# EAGLE schematic sha2017_rev1_0_0 (EAGLE 6.6.0)
Assembly variants: PRODUCTION

## Sheet 1 of 3
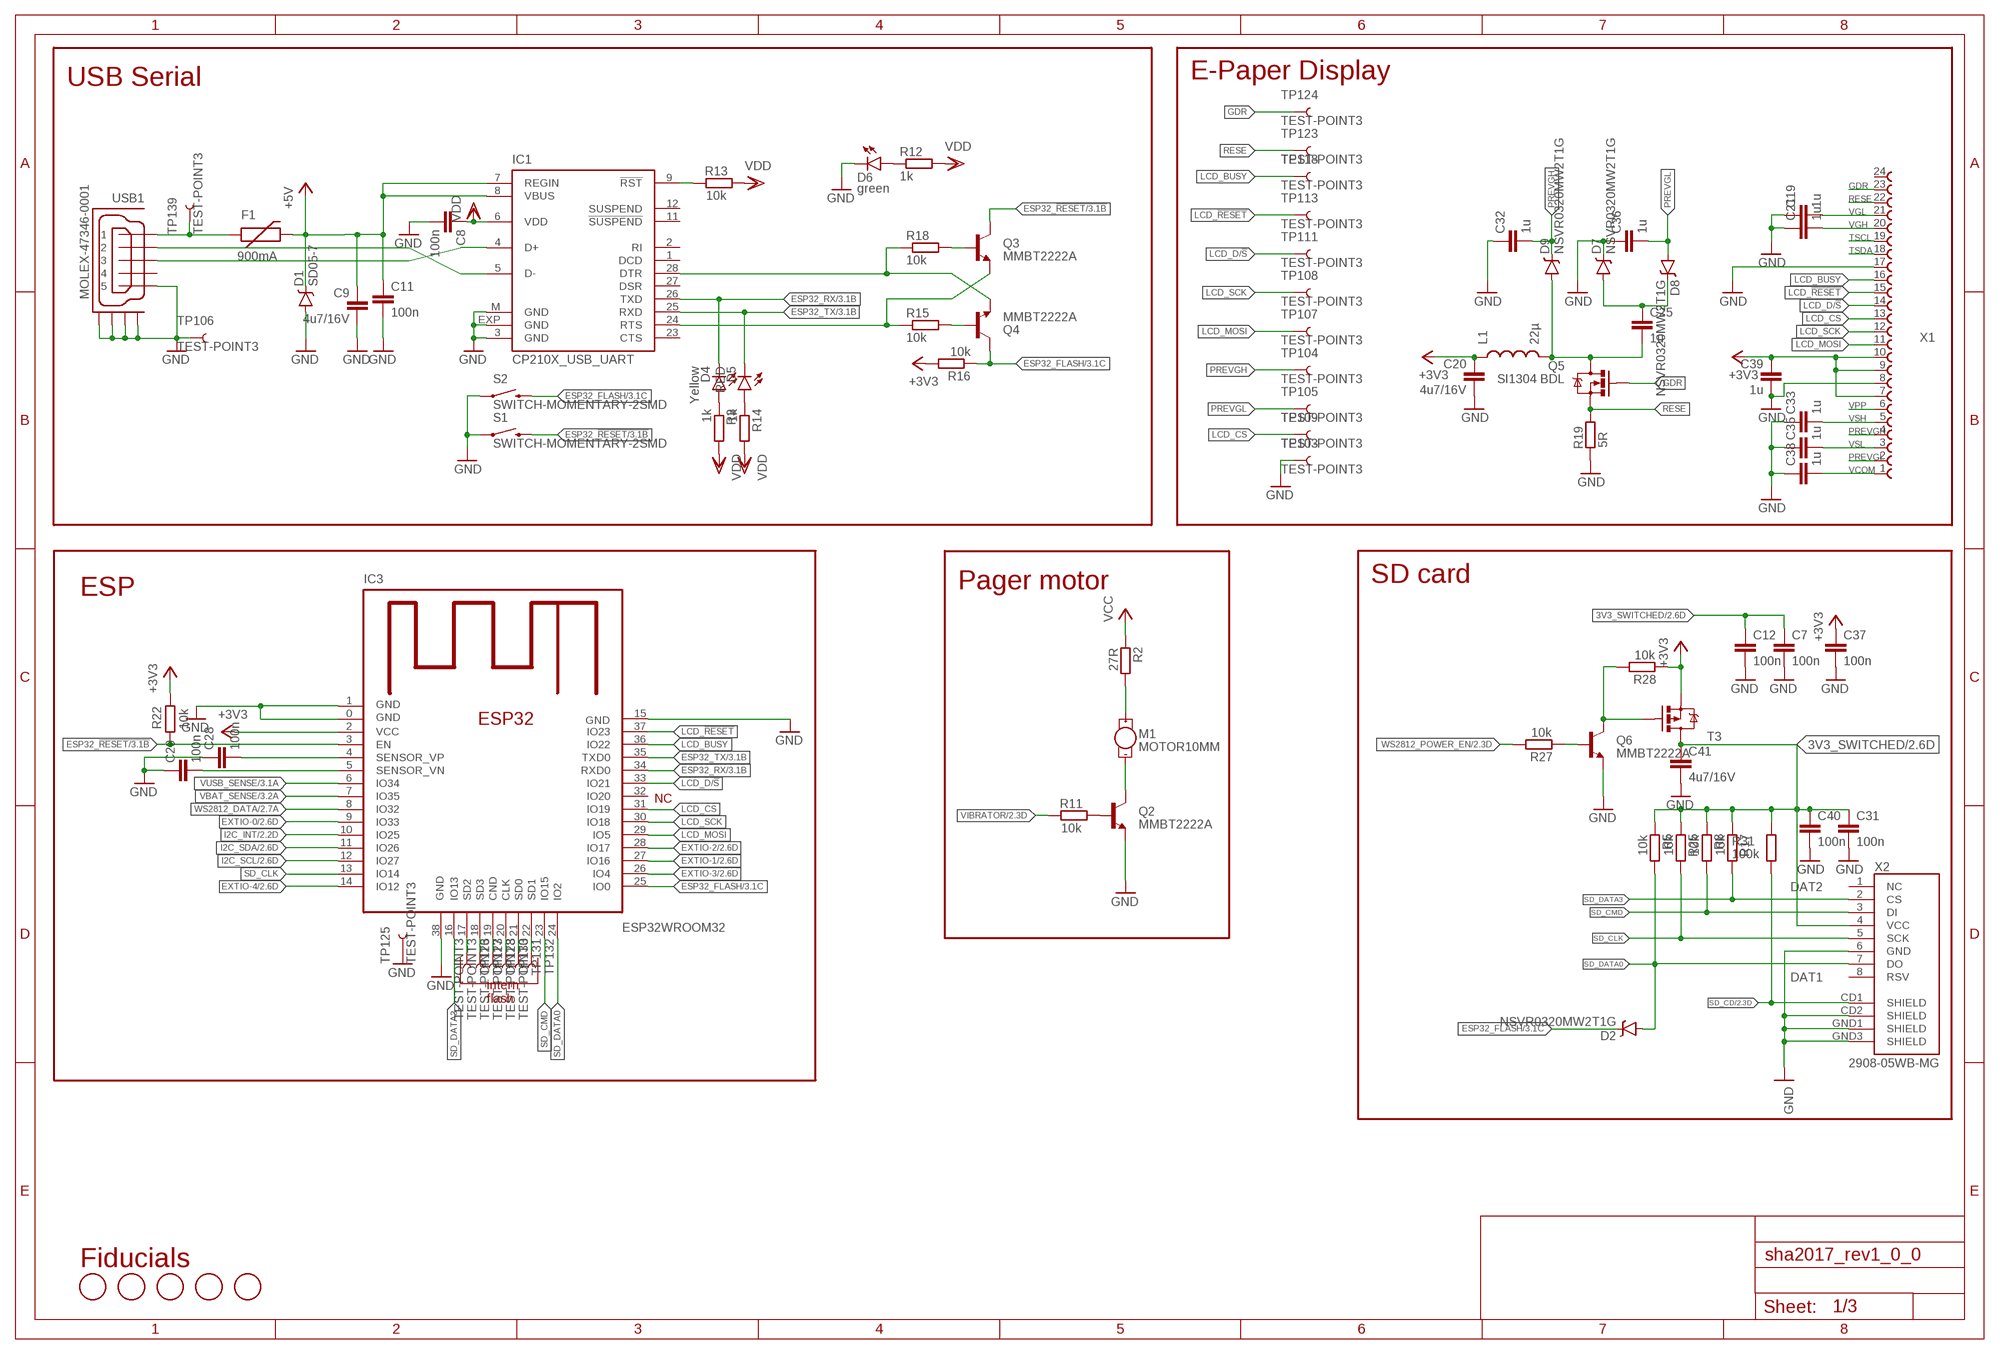
[diagram p0: schematic, sheet 1]

### Parts
C7  100n  C0603-DASHES  [C0603-DASHES]
C8  100n  C0603-DASHES  [C0603-DASHES]
C9  4u7/16V  C-EUC0805  [C0805]
C11  100n  C0603-DASHES  [C0603-DASHES]
C12  100n  C0603-DASHES  [C0603-DASHES]
C19  1u  C0603-DASHES  [C0603-DASHES]
C20  4u7/16V  C-EUC0805  [C0805]
C21  1u  C0603-DASHES  [C0603-DASHES]
C25  1u  C0603-DASHES  [C0603-DASHES]
C28  100n  C0603-DASHES  [C0603-DASHES]
C29  100n  C0603-DASHES  [C0603-DASHES]
C31  100n  C0603-DASHES  [C0603-DASHES]
C32  1u  C0603-DASHES  [C0603-DASHES]
C33  1u  C0603-DASHES  [C0603-DASHES]
C35  1u  C0603-DASHES  [C0603-DASHES]
C36  1u  C0603-DASHES  [C0603-DASHES]
C37  100n  C0603-DASHES  [C0603-DASHES]
C38  1u  C0603-DASHES  [C0603-DASHES]
C39  1u  C0603-DASHES  [C0603-DASHES]
C40  100n  C0603-DASHES  [C0603-DASHES]
C41  4u7/16V  C-EUC0805  [C0805]
D1  SD05-7  DIODE-SCHOTTKY-PMEG4005EJ  [SOD-323]
D2  NSVR0320MW2T1G  BAT20JFILM  [SOD-323]
D4  Yellow  LED0603  [LED-0603]
D5  RED  LED0603  [LED-0603]
D6  green  LED0603  [LED-0603]
D7  NSVR0320MW2T1G  BAT20JFILM  [SOD-323]
D8  NSVR0320MW2T1G  BAT20JFILM  [SOD-323]
D9  NSVR0320MW2T1G  BAT20JFILM  [SOD-323]
F1  900mA  PTCSMD  [PTC-1206]
FD1  FIDUCIAL  [FIDUCIAL_1MM]
FD2  FIDUCIAL  [FIDUCIAL_1MM]
FD3  FIDUCIAL  [FIDUCIAL_1MM]
FD4  FIDUCIAL  [FIDUCIAL_1MM]
FD5  FIDUCIAL  [FIDUCIAL_1MM]
IC1  CP210X_USB_UART  [MLP28]
IC3  ESP32WROOM32  [ESP32MOD]
L1  22µ  INDUCTOR1210  [1210]
M1  MOTOR10MM  [VIBE-MOTOR-10MM]
Q2  MMBT2222A  TRANSISTOR_NPNMMBT2222A  [SOT23-3]
Q3  MMBT2222A  TRANSISTOR_NPNMMBT2222A  [SOT23-3]
Q4  MMBT2222A  TRANSISTOR_NPNMMBT2222A  [SOT23-3]
Q5  SI1304 BDL  MOSFET-NCHANNEL2N7002PW  [SOT323]
Q6  MMBT2222A  TRANSISTOR_NPNMMBT2222A  [SOT23-3]
R2  27R  R-EU_R1206  [R1206]
R3  1k  R0603-DASHES  [R0603-DASHES]
R5  10k  R0603-DASHES  [R0603-DASHES]
R8  10k  R0603-DASHES  [R0603-DASHES]
R11  10k  R0603-DASHES  [R0603-DASHES]
R12  1k  R0603-DASHES  [R0603-DASHES]
R13  10k  R0603-DASHES  [R0603-DASHES]
R14  1k  R0603-DASHES  [R0603-DASHES]
R15  10k  R0603-DASHES  [R0603-DASHES]
R16  10k  R0603-DASHES  [R0603-DASHES]
R17  10k  R0603-DASHES  [R0603-DASHES]
R18  10k  R0603-DASHES  [R0603-DASHES]
R19  5R  R0603-DASHES  [R0603-DASHES]
R22  10k  R0603-DASHES  [R0603-DASHES]
R25  10k  R0603-DASHES  [R0603-DASHES]
R27  10k  R0603-DASHES  [R0603-DASHES]
R28  10k  R0603-DASHES  [R0603-DASHES]
R31  100k  R0603-DASHES  [R0603-DASHES]
S1  SWITCH-MOMENTARY-2SMD  [TACTILE-SWITCH-SMD]
S2  SWITCH-MOMENTARY-2SMD  [TACTILE-SWITCH-SMD]
T3  MOSFET-PCHANNEL  [SOT23-3]
TP103  TEST-POINT3  [PAD.03X.03]
TP104  TEST-POINT3  [PAD.03X.03]
TP105  TEST-POINT3  [PAD.03X.03]
TP106  TEST-POINT3  [PAD.03X.03]
TP107  TEST-POINT3  [PAD.03X.03]
TP108  TEST-POINT3  [PAD.03X.03]
TP109  TEST-POINT3  [PAD.03X.03]
TP111  TEST-POINT3  [PAD.03X.03]
TP113  TEST-POINT3  [PAD.03X.03]
TP118  TEST-POINT3  [PAD.03X.03]
TP123  TEST-POINT3  [PAD.03X.03]
TP124  TEST-POINT3  [PAD.03X.03]
TP125  TEST-POINT3  [PAD.03X.03]
TP126  TEST-POINT3  [PAD.03X.03]
TP127  TEST-POINT3  [PAD.03X.03]
TP128  TEST-POINT3  [PAD.03X.03]
TP130  TEST-POINT3  [PAD.03X.03]
TP131  TEST-POINT3  [PAD.03X.03]
TP132  TEST-POINT3  [PAD.03X.03]
TP139  TEST-POINT3  [PAD.03X.03]
USB1  MOLEX-47346-0001  [MOLEX-47364-0001]
X1  68712414022  [68712414022]
X2  2908-05WB-MG  [MICRO-SD-SOCKET-PP]  (not fitted in variant PRODUCTION)

### Nets
3V3_SWITCHED: C7.1 C12.1 C31.1 C40.1 C41.1 R5.2 R8.2 R17.2 R25.2 R31.1 T3.3(D) X2.4(VCC) ; also sheet 2,3
+3V3: C20.1 C37.1 C39.1 IC3.2(VCC) L1.1 R16.2 R22.1 R28.2 T3.2(S) X1.7 X1.9 X1.10 ; also sheet 2,3
+5V [GND/3V3]: C9.1 C11.1 D1.C F1.2 IC1.7(REGIN) IC1.8(VBUS) ; also sheet 2,3
CD0: IC3.21(SD0) TP131.P$1
CLK: IC3.20(CLK) TP130.P$1
CND: IC3.19(CND) TP128.P$1
ESP32_!RESET: IC3.3(EN) Q3.3(C) R22.2 S1.3 ; also sheet 3
ESP32_FLASH: D2.C IC3.25(IO0) Q4.3(C) R16.1 S2.3 ; also sheet 3
ESP32_RX: D4.C IC1.26(TXD) IC3.34(RXD0) ; also sheet 3
ESP32_TX: D5.C IC1.25(RXD) IC3.35(TXD0) ; also sheet 3
EXTIO-0: IC3.9(IO33) ; also sheet 2
EXTIO-1: IC3.27(IO16) ; also sheet 2
EXTIO-2: IC3.28(IO17) ; also sheet 2
EXTIO-3: IC3.26(IO4) ; also sheet 2
EXTIO-4: IC3.14(IO12) ; also sheet 2
GDR: Q5.1(G) TP124.P$1 X1.23
GND [GND/3V3]: C7.2 C8.2 C9.2 C11.2 C12.2 C19.1 C20.2 C21.1 C28.1 C29.1 C31.2 C32.1 C33.1 C35.1 C36.1 C37.2 C38.1 C39.2 C40.2 C41.2 D1.A D6.C D7.C IC1.3(GND) IC1.EXP(GND) IC1.M(GND) IC3.0(GND) IC3.1(GND) IC3.15(GND) IC3.38(GND) Q2.2(E) Q6.2(E) R19.2 S1.1 S2.1 TP103.P$1 TP106.P$1 TP125.P$1 USB1.5 USB1.GND1 USB1.GND2 USB1.GND3 USB1.GND4 X1.8 X1.17 X2.6(GND) X2.CD2(SHIELD) X2.GND1(SHIELD) X2.GND3(SHIELD) ; also sheet 2,3
I2C_INT: IC3.10(IO25) ; also sheet 2
I2C_SCL: IC3.12(IO27) ; also sheet 2,3
I2C_SDA: IC3.11(IO26) ; also sheet 2,3
LCD_!RESET: IC3.37(IO23) TP113.P$1 X1.15
LCD_BUSY: IC3.36(IO22) TP118.P$1 X1.16
LCD_CS: IC3.31(IO19) TP109.P$1 X1.13
LCD_D/!S: IC3.33(IO21) TP111.P$1 X1.14
LCD_MOSI: IC3.29(IO5) TP107.P$1 X1.11
LCD_SCK: IC3.30(IO18) TP108.P$1 X1.12
N$8: IC1.9(!RST) R13.2
N$10: IC1.24(RTS) Q3.2(E) R15.1
N$11: IC1.28(DTR) Q4.2(E) R18.1
N$13: Q4.1(B) R15.2
N$14: Q3.1(B) R18.2
N$15: Q6.1(B) R27.2
N$16: M1.- Q2.3(C)
N$17: Q6.3(C) R28.1 T3.1(G)
N$18: M1.+ R2.1
N$22: C25.1 D7.A D8.C
N$23: C25.2 D9.A L1.2 Q5.3(D)
N$26: D6.A R12.1
N$27: D4.A R3.1
N$28: D5.A R14.1
N$32 [GND/3V3]: F1.1 TP139.P$1 USB1.1
N$42: C28.2 IC3.4(SENSOR_VP)
N$43: C29.2 IC3.5(SENSOR_VN)
N$45: Q2.1(B) R11.1
PREVGH: C32.2 D9.C TP104.P$1 X1.4
PREVGL: C36.2 D8.A TP105.P$1 X1.2
RESE: Q5.2(S) R19.1 TP123.P$1 X1.22
SD1: IC3.22(SD1) TP132.P$1
SD2: IC3.17(SD2) TP126.P$1
SD3: IC3.18(SD3) TP127.P$1
SD_CD: R31.2 X2.CD1(SHIELD) ; also sheet 2
SD_CLK: IC3.13(IO14) R25.1 X2.5(SCK)
SD_CMD: IC3.23(IO15) R8.1 X2.3(DI)
SD_DATA0: D2.A IC3.24(IO2) R5.1 X2.7(DO)
SD_DATA3: IC3.16(IO13) R17.1 X2.2(CS)
TSCL: X1.19
TSDA: X1.18
USB_DN_CON: IC1.5(D-) USB1.2 ; also sheet 3
USB_DP_CON: IC1.4(D+) USB1.3 ; also sheet 3
VBAT_SENSE: IC3.7(IO35) ; also sheet 3
VCC [FAT]: R2.2 ; also sheet 2,3
VCOM: C38.2 X1.1
VDD: C8.1 IC1.6(VDD) R3.2 R12.2 R13.1 R14.2
VGH: C21.2 X1.20
VGL: C19.2 X1.21
VIBRATOR: R11.2 ; also sheet 2
VPP: X1.6
VSH: C33.2 X1.5
VSL: C35.2 X1.3
VUSB_SENSE: IC3.6(IO34) ; also sheet 3
WS2812_DATA: IC3.8(IO32) ; also sheet 2,3
WS2812_POWER_EN: R27.1 ; also sheet 2
Unconnected: IC1.1(DCD) IC1.2(RI) IC1.11(!SUSPEND) IC1.12(SUSPEND) IC1.23(CTS) IC1.27(DSR) IC3.32(IO20) USB1.4 X1.24 X2.1(NC) X2.8(RSV)

### Notes on the sheet
- USB Serial | E-Paper Display
- Pager motor | SD card
- ESP
- NC
- DAT2
- DAT1
- intern
  flash
- Fiducials

## Sheet 2 of 3
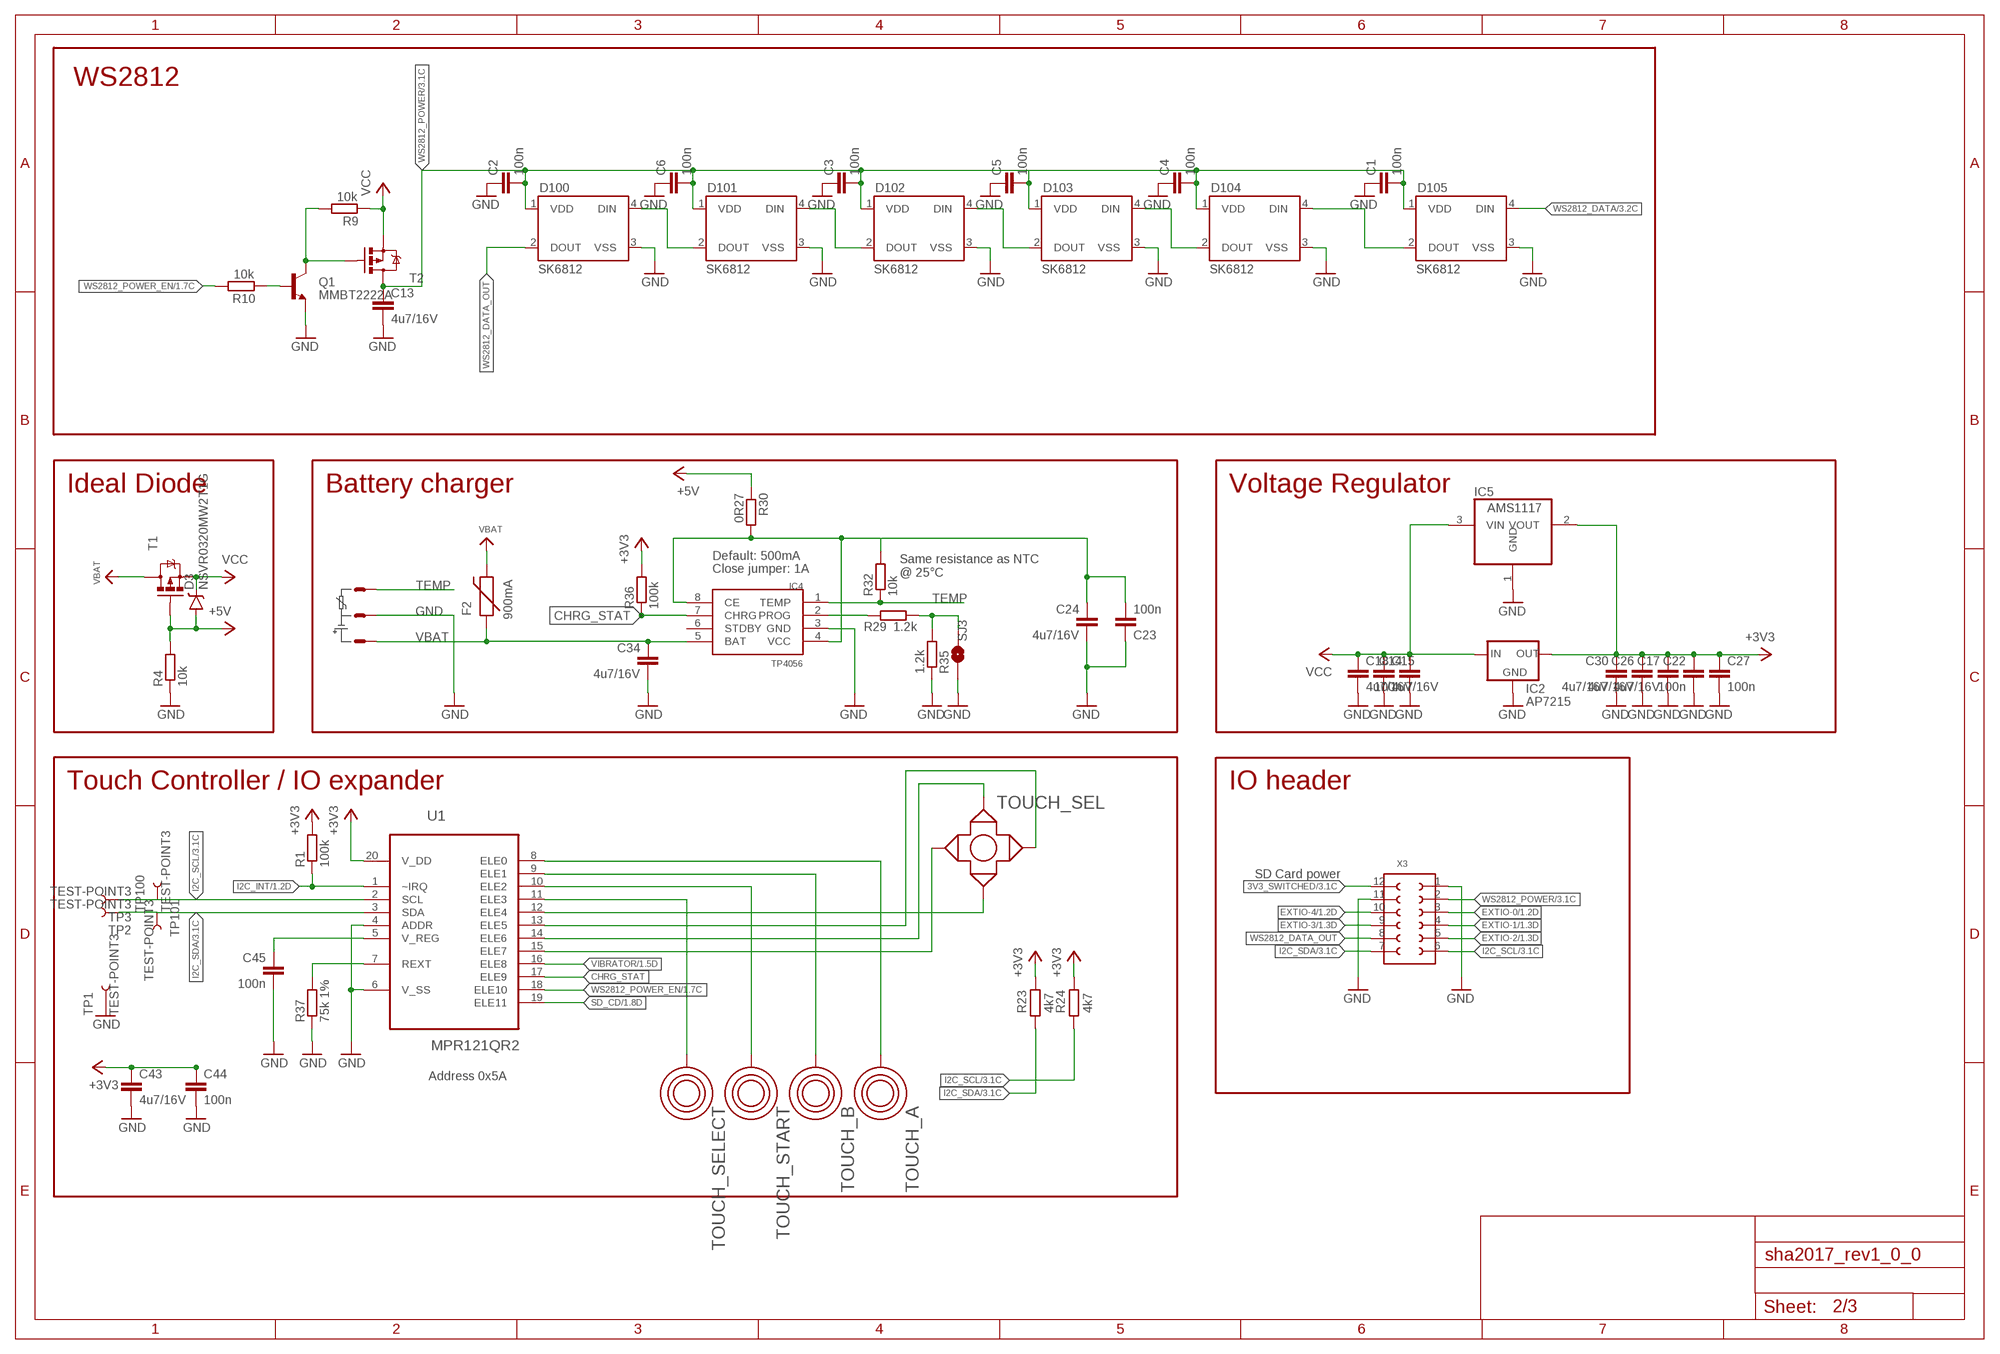
[diagram p1: schematic, sheet 2]

### Parts
C1  100n  C0603-DASHES  [C0603-DASHES]
C2  100n  C0603-DASHES  [C0603-DASHES]
C3  100n  C0603-DASHES  [C0603-DASHES]
C4  100n  C0603-DASHES  [C0603-DASHES]
C5  100n  C0603-DASHES  [C0603-DASHES]
C6  100n  C0603-DASHES  [C0603-DASHES]
C13  4u7/16V  C-EUC0805  [C0805]
C14  100n  C0603-DASHES  [C0603-DASHES]
C15  4u7/16V  C-EUC0805  [C0805]
C17  4u7/16V  C-EUC0805  [C0805]
C18  4u7/16V  C-EUC0805  [C0805]
C22  100n  C0603-DASHES  [C0603-DASHES]
C23  100n  C0603-DASHES  [C0603-DASHES]
C24  4u7/16V  C-EUC0805  [C0805]
C26  4u7/16V  C-EUC0805  [C0805]
C27  100n  C0603-DASHES  [C0603-DASHES]
C30  4u7/16V  C-EUC0805  [C0805]
C34  4u7/16V  C-EUC0805  [C0805]
C43  4u7/16V  C-EUC0805  [C0805]
C44  100n  C0603-DASHES  [C0603-DASHES]
C45  100n  C0603-DASHES  [C0603-DASHES]
D3  NSVR0320MW2T1G  BAT20JFILM  [SOD-323]
D100  SK6812  WS2812B  [WS2812B]
D101  SK6812  WS2812B  [WS2812B]
D102  SK6812  WS2812B  [WS2812B]
D103  SK6812  WS2812B  [WS2812B]
D104  SK6812  WS2812B  [WS2812B]
D105  SK6812  WS2812B  [WS2812B]
F2  900mA  PTCSMD  [PTC-1206]
IC2  AP7215  [SOT89]
IC4  TP4056  [SOP-8]
IC5  AMS1117  REG1117  [SOT223]
Q1  MMBT2222A  TRANSISTOR_NPNMMBT2222A  [SOT23-3]
R1  100k  R0603-DASHES  [R0603-DASHES]
R4  10k  R0603-DASHES  [R0603-DASHES]
R9  10k  R0603-DASHES  [R0603-DASHES]
R10  10k  R0603-DASHES  [R0603-DASHES]
R23  4k7  R0603-DASHES  [R0603-DASHES]
R24  4k7  R0603-DASHES  [R0603-DASHES]
R29  1.2k  R0603-DASHES  [R0603-DASHES]
R30  0R27  R-EU_R1206  [R1206]
R32  10k  R0603-DASHES  [R0603-DASHES]
R35  1.2k  R0603-DASHES  [R0603-DASHES]
R36  100k  R0603-DASHES  [R0603-DASHES]
R37  75k 1%  R0603-DASHES  [R0603-DASHES]
SJ3  JUMPER-PAD-2-NOYES_SILK  [PAD-JUMPER-2-NO_YES_SILK]
T1  MOSFET-PCHANNEL  [SOT23-3]
T2  MOSFET-PCHANNEL  [SOT23-3]
TOUCH_A  TOUCHROUND  [TOUCH_BUTTON]
TOUCH_B  TOUCHROUND  [TOUCH_BUTTON]
TOUCH_SEL  TOUCH_CROSS  [TOUCH_CROSS]
TOUCH_SELECT  TOUCHSELECT  [TOUCH_SELECT]
TOUCH_START  TOUCHSELECT  [TOUCH_SELECT]
TP1  TEST-POINT3  [PAD.03X.03]
TP2  TEST-POINT3  [PAD.03X.03]
TP3  TEST-POINT3  [PAD.03X.03]
TP100  TEST-POINT3  [PAD.03X.03]
TP101  TEST-POINT3  [PAD.03X.03]
U1  MPR121QR2  [QFN40P300X300X60-20N]
X3  610X12243021  [610X12243021]
X4  JST-PH3  [JST-PH3]

### Nets
3V3_SWITCHED: X3.12 ; also sheet 1,3
+3V3: C17.1 C22.1 C26.1 C27.1 C30.1 C43.1 C44.1 IC2.3(OUT) IC5.2(VOUT) R1.2 R23.1 R24.1 R36.2 U1.20(V_DD) ; also sheet 1,3
+5V [GND/3V3]: D3.A R4.2 R30.1 T1.1(G) ; also sheet 1,3
CHRG_STAT: IC4.7(CHRG) R36.1 U1.17(ELE9)
EXTIO-0: X3.3 ; also sheet 1
EXTIO-1: X3.4 ; also sheet 1
EXTIO-2: X3.5 ; also sheet 1
EXTIO-3: X3.9 ; also sheet 1
EXTIO-4: X3.10 ; also sheet 1
GND [GND/3V3]: C1.1 C2.1 C3.1 C4.1 C5.1 C6.1 C13.2 C14.2 C15.2 C17.2 C18.2 C22.2 C23.1 C24.2 C26.2 C27.2 C30.2 C34.2 C43.2 C44.2 C45.2 D100.3(VSS) D101.3(VSS) D102.3(VSS) D103.3(VSS) D104.3(VSS) D105.3(VSS) IC2.1(GND) IC4.3(GND) IC5.1(GND) Q1.2(E) R4.1 R35.2 R37.1 SJ3.1 TP1.P$1 U1.4(ADDR) U1.6(V_SS) X3.1 X3.11 X4.2 ; also sheet 1,3
I2C_INT: R1.1 U1.1(~IRQ) ; also sheet 1
I2C_SCL: R24.2 TP3.P$1 TP100.P$1 U1.2(SCL) X3.6 ; also sheet 1,3
I2C_SDA: R23.2 TP2.P$1 TP101.P$1 U1.3(SDA) X3.7 ; also sheet 1,3
N$1 [Touch]: TOUCH_B.P$1 U1.9(ELE1)
N$2: D100.4(DIN) D101.2(DOUT)
N$3: D103.4(DIN) D104.2(DOUT)
N$4: D104.4(DIN) D105.2(DOUT)
N$6 [Touch]: TOUCH_A.P$1 U1.8(ELE0)
N$7: IC4.2(PROG) R29.1
N$9: R29.2 R35.1 SJ3.2
N$12 [GND/3V3]: C23.2 C24.1 IC4.4(VCC) IC4.8(CE) R30.2 R32.2
N$19: D101.4(DIN) D102.2(DOUT)
N$20: C45.1 U1.5(V_REG)
N$21: R37.2 U1.7(REXT)
N$24 [Touch]: TOUCH_START.P$1 U1.10(ELE2)
N$25 [Touch]: TOUCH_SELECT.P$1 U1.11(ELE3)
N$44 [Touch]: TOUCH_SEL.D(DOWN) U1.12(ELE4)
N$46 [Touch]: TOUCH_SEL.L(LEFT) U1.15(ELE7)
N$47 [Touch]: TOUCH_SEL.UP U1.14(ELE6)
N$48 [Touch]: TOUCH_SEL.R(RIGHT) U1.13(ELE5)
N$49 [FAT]: C34.1 F2.1 IC4.5(BAT) X4.3
N$50: D102.4(DIN) D103.2(DOUT)
N$52: Q1.1(B) R10.2
N$53: Q1.3(C) R9.1 T2.1(G)
SD_CD: U1.19(ELE11) ; also sheet 1
TEMP: IC4.1(TEMP) R32.1 X4.1
VBAT [FAT]: F2.2 T1.3(D) ; also sheet 3
VCC [FAT]: C14.1 C15.1 C18.1 D3.C IC2.2(IN) IC2.2@(IN) IC5.3(VIN) R9.2 T1.2(S) T2.2(S) ; also sheet 1,3
VIBRATOR: U1.16(ELE8) ; also sheet 1
WS2812_DATA: D105.4(DIN) ; also sheet 1,3
WS2812_DATA_OUT: D100.2(DOUT) X3.8
WS2812_POWER: C1.2 C2.2 C3.2 C4.2 C5.2 C6.2 C13.1 D100.1(VDD) D101.1(VDD) D102.1(VDD) D103.1(VDD) D104.1(VDD) D105.1(VDD) T2.3(D) X3.2 ; also sheet 3
WS2812_POWER_EN: R10.1 U1.18(ELE10) ; also sheet 1
Unconnected: IC4.6(STDBY)

### Notes on the sheet
- WS2812
- Ideal Diode | Battery charger | Voltage Regulator
- Default: 500mA
- Close jumper: 1A
- Same resistance as NTC
  @ 25°C
- GND
- VBAT
- Touch Controller / IO expander | IO header
- SD Card power
- Address 0x5A

## Sheet 3 of 3
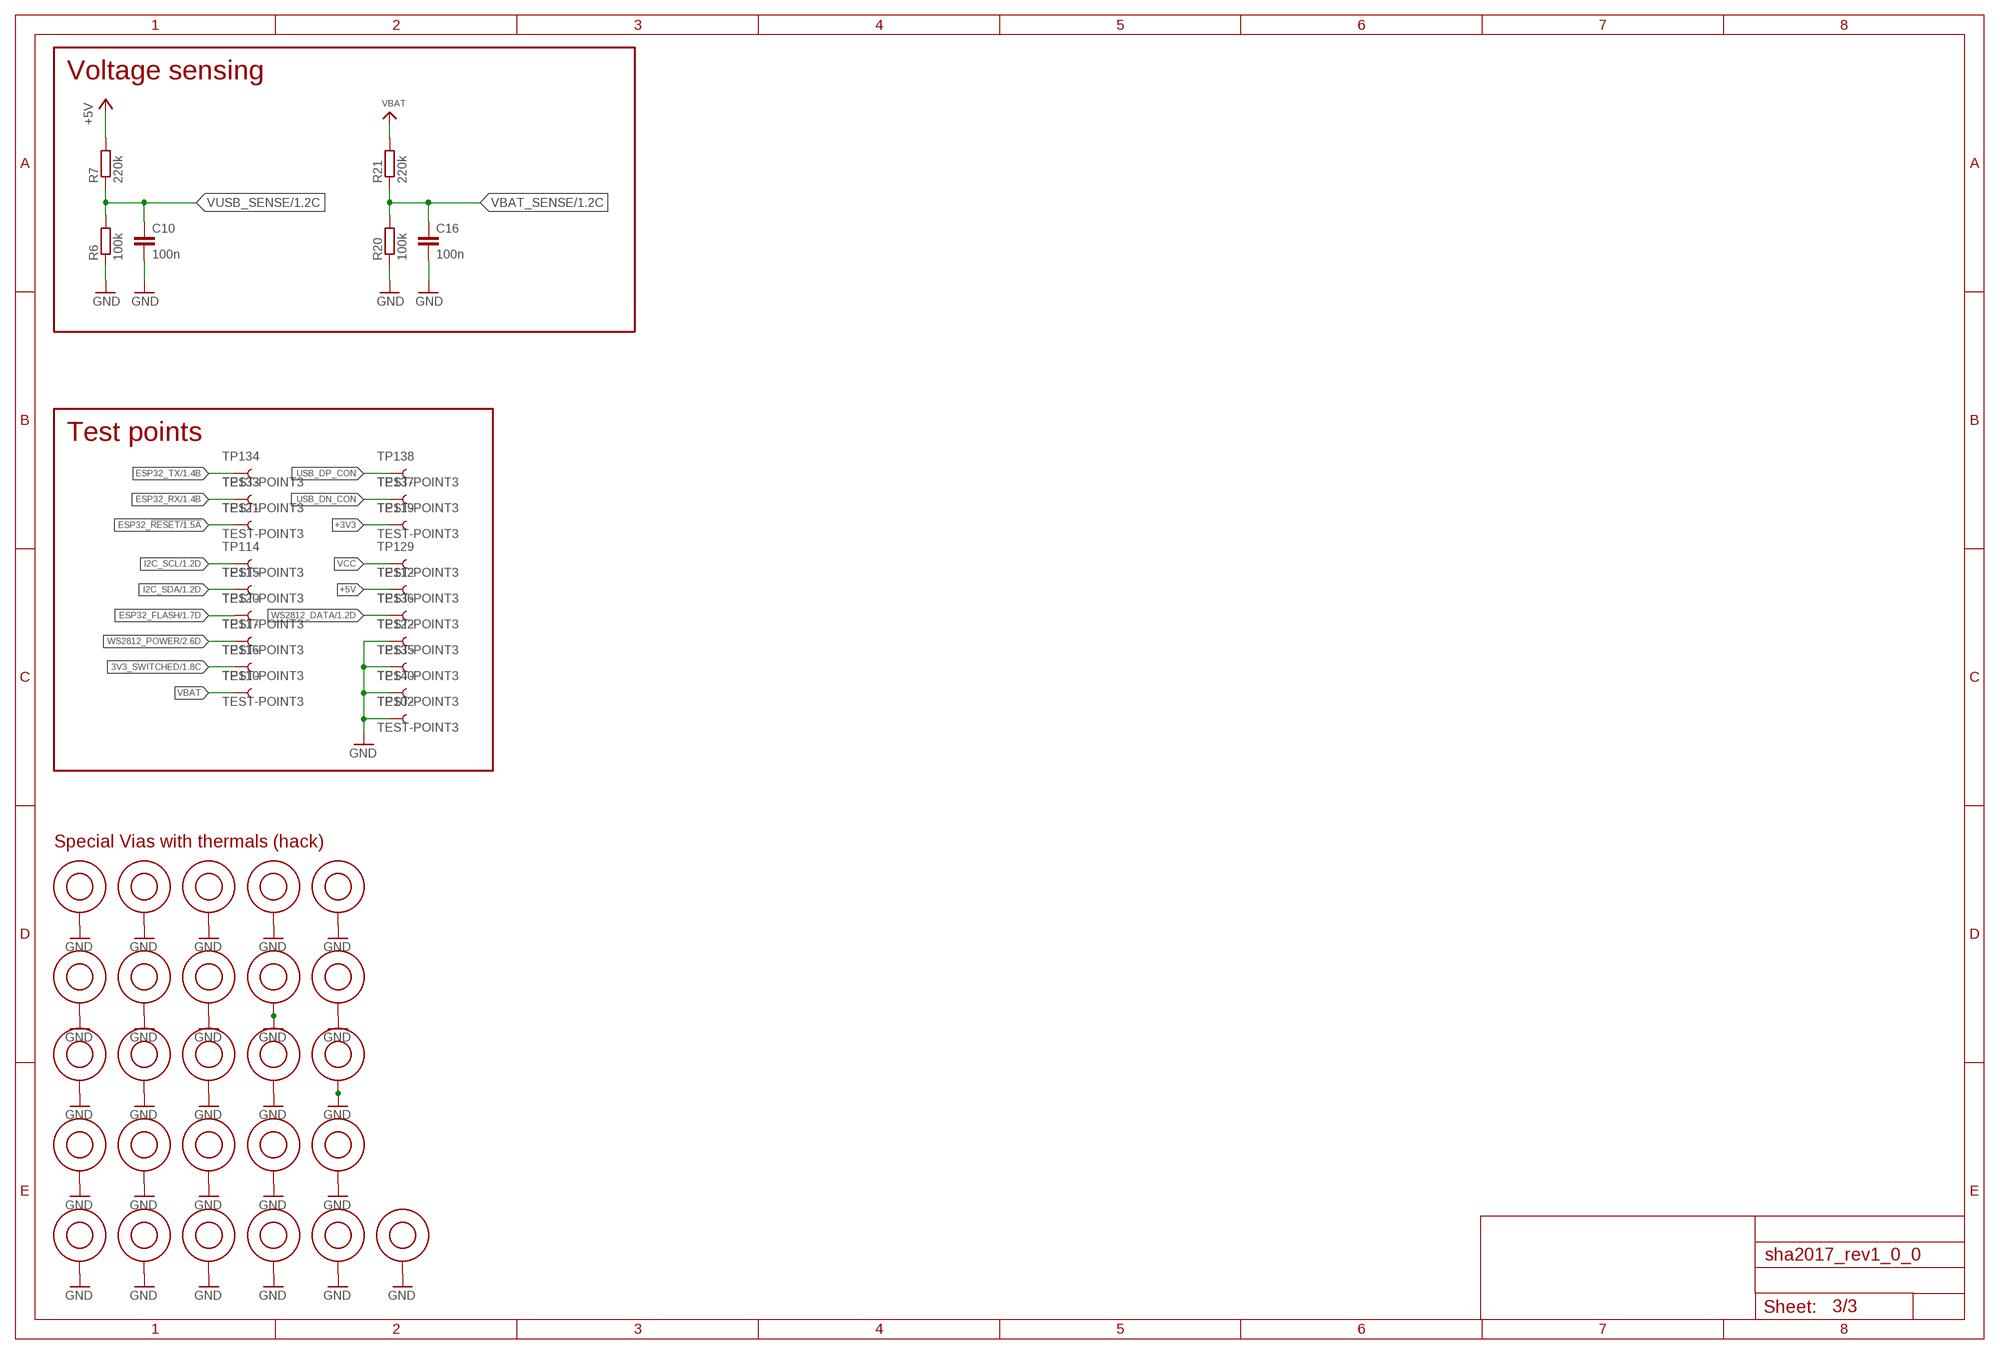
[diagram p2: schematic, sheet 3]

### Parts
$$U$1  VIA  [VIA]
$$U$2  VIA  [VIA]
$$U$3  VIA  [VIA]
$$U$4  VIA  [VIA]
$$U$5  VIA  [VIA]
$$U$6  VIA  [VIA]
$$U$7  VIA  [VIA]
$$U$8  VIA  [VIA]
$$U$9  VIA  [VIA]
C10  100n  C0603-DASHES  [C0603-DASHES]
C16  100n  C0603-DASHES  [C0603-DASHES]
R6  100k  R0603-DASHES  [R0603-DASHES]
R7  220k  R0603-DASHES  [R0603-DASHES]
R20  100k  R0603-DASHES  [R0603-DASHES]
R21  220k  R0603-DASHES  [R0603-DASHES]
TP102  TEST-POINT3  [PAD.03X.03]
TP110  TEST-POINT3  [PAD.03X.03]
TP112  TEST-POINT3  [PAD.03X.03]
TP114  TEST-POINT3  [PAD.03X.03]
TP115  TEST-POINT3  [PAD.03X.03]
TP116  TEST-POINT3  [PAD.03X.03]
TP117  TEST-POINT3  [PAD.03X.03]
TP119  TEST-POINT3  [PAD.03X.03]
TP120  TEST-POINT3  [PAD.03X.03]
TP121  TEST-POINT3  [PAD.03X.03]
TP122  TEST-POINT3  [PAD.03X.03]
TP129  TEST-POINT3  [PAD.03X.03]
TP133  TEST-POINT3  [PAD.03X.03]
TP134  TEST-POINT3  [PAD.03X.03]
TP135  TEST-POINT3  [PAD.03X.03]
TP136  TEST-POINT3  [PAD.03X.03]
TP137  TEST-POINT3  [PAD.03X.03]
TP138  TEST-POINT3  [PAD.03X.03]
TP140  TEST-POINT3  [PAD.03X.03]
U$2  VIA  [VIA]
U$3  VIA  [VIA]
U$4  VIA  [VIA]
U$5  VIA  [VIA]
U$6  VIA  [VIA]
U$10  VIA  [VIA]
U$11  VIA  [VIA]
U$12  VIA  [VIA]
U$13  VIA  [VIA]
U$14  VIA  [VIA]
U$15  VIA  [VIA]
U$16  VIA  [VIA]
U$17  VIA  [VIA]
U$18  VIA  [VIA]
U$19  VIA  [VIA]
U$20  VIA  [VIA]
U$21  VIA  [VIA]
U$22  VIA  [VIA]
U$23  VIA  [VIA]

### Nets
3V3_SWITCHED: TP116.P$1 ; also sheet 1,2
+3V3: TP119.P$1 ; also sheet 1,2
+5V [GND/3V3]: R7.2 TP112.P$1 ; also sheet 1,2
ESP32_!RESET: TP121.P$1 ; also sheet 1
ESP32_FLASH: TP120.P$1 ; also sheet 1
ESP32_RX: TP133.P$1 ; also sheet 1
ESP32_TX: TP134.P$1 ; also sheet 1
GND [GND/3V3]: $$U$1.P$1 $$U$2.P$1 $$U$3.P$1 $$U$4.P$1 $$U$5.P$1 $$U$6.P$1 $$U$7.P$1 $$U$8.P$1 $$U$9.P$1 C10.2 C16.2 R6.1 R20.1 TP102.P$1 TP122.P$1 TP135.P$1 TP140.P$1 U$2.P$1 U$3.P$1 U$4.P$1 U$5.P$1 U$6.P$1 U$10.P$1 U$11.P$1 U$12.P$1 U$13.P$1 U$14.P$1 U$15.P$1 U$16.P$1 U$17.P$1 U$18.P$1 U$19.P$1 U$20.P$1 U$21.P$1 U$22.P$1 U$23.P$1 ; also sheet 1,2
I2C_SCL: TP114.P$1 ; also sheet 1,2
I2C_SDA: TP115.P$1 ; also sheet 1,2
USB_DN_CON: TP137.P$1 ; also sheet 1
USB_DP_CON: TP138.P$1 ; also sheet 1
VBAT [FAT]: R21.2 TP110.P$1 ; also sheet 2
VBAT_SENSE: C16.1 R20.2 R21.1 ; also sheet 1
VCC [FAT]: TP129.P$1 ; also sheet 1,2
VUSB_SENSE: C10.1 R6.2 R7.1 ; also sheet 1
WS2812_DATA: TP136.P$1 ; also sheet 1,2
WS2812_POWER: TP117.P$1 ; also sheet 2

### Notes on the sheet
- Voltage sensing
- Test points
- Special Vias with thermals (hack)

## Library data of the parts
$$U$1-$$U$9 U$2-U$6 U$10-U$23 = badge:VIA; PARTNO: NAP
C1-C8 C11 C12 C14 C22 C23 C27 C31 C37 C40 C44 C45 = sha2017_rev0_1_0_dev:C0603-DASHES; PARTNO: GRM188R71H104KA93D
C9 C13 C15 C17 C18 C20 C24 C26 C30 C34 C41 C43 = rcl:C-EU: CAPACITOR, European symbol; PARTNO: GRM21BR61C475KA88K
C10 C16 C28 C29 = sha2017_rev0_1_0_dev:C0603-DASHES; OC_FARNELL: unknown; PARTNO: GRM188R71H104KA93D
C19 C21 C25 C32 C33 C35 C36 C38 C39 = sha2017_rev0_1_0_dev:C0603-DASHES; PARTNO: GRM188R61E105KA12D
D1 = SparkFun-DiscreteSemi:DIODE-SCHOTTKY: Schottky diodes in SFE's production catalog BAT20J 1A 23V 0.62Vf RB751 120mA 40V 0.37Vf PMEG4005EJ 0.5A 40V 0.42Vf MBRA140 1A 40V 0.5Vf B340A 3A 40V SMA; PARTNO: SD05-7; PROD_ID: DIO-10955; VALUE: PMEG4005EJ
D2 D3 D7-D9 = SparkFun-DiscreteSemi:BAT20JFILM: 23V, 1A Schottky diode, SOD-323 package; PARTNO: BAT20JFILM; PROD_ID: DIO-11623; VALUE: BAT20JFILM
D4-D6 = SparkFun-LED:LED: LEDs Standard schematic elements and footprints for 5mm, 3mm, 1206, and 0603 sized LEDs. 5mm - Spark Fun Electronics SKU : COM-00529 (and others)
D100-D105 = SparkFun-LED:WS2812B: WS2812B - Intelligent control LED integrated light source Technical Specifications: Power Supply Voltage (VDD): 3.5 to 5.3 V Input Voltage (VI): -0.5 to VDD+0.5 V Operating Junction Temperature (Topt): -25°C to +80°C Storage Temperature Range (Tstg): -55°C to +150°C; PARTNO: SK6812
F1 F2 = SparkFun-PowerIC:PTC: Resettable Fuse PTC Resettable Fuse. Spark Fun Electronics SKU : COM-08357; PROD_ID: RES-11150
FD1-FD5 = adafruit:FIDUCIAL: For use by pick and place machines to calibrate the vision/machine, 1mm By microbuilder.eu; OC_FARNELL: unknown; PARTNO: NAP
IC1 = SparkFun-DigitalIC:CP210X_USB_UART: Single-Chip USB to UART Bridge Source: www.silabs.com .. CP2101.pdf / cp2102.pdf. Spark Fun Electronics SKU : COM-00310; PARTNO: CP2102-GMR
IC2 = badge:AP7215; PARTNO: AP7215-33YG-13
IC3 = ESP3x:ESP32WROOM32
IC4 = TP4056:TP4056
IC5 = burr-brown:REG1117: 800mA and 1A Low Dropout (LDO) Positive Regulator 1.8V, 2.5V, 2.85V, 3.3V, 5V, and Adj; MPN: REG1117; OC_FARNELL: 1097566; OC_NEWARK: 14P6981
L1 = SparkFun-Passives:INDUCTOR: Inductors Basic Inductor/Choke - 0603 and 1206. Footprints are not proven and vary greatly between part numbers. SRN6045- 33uH, 20% 1.4A SDR0403-560KL - 56uH, 10%, 500mA RMS/740mA peak; PARTNO: NLCV32T-220K-EF
M1 = badge:MOTOR: Vibration Motor- ROB-08449 Physical dimension and wire connections for this powerful vibration motor. Motor has a self adhesive backing.
Q1-Q4 Q6 = SparkFun-DiscreteSemi:TRANSISTOR_NPN: Generic NPN BJT MMBT2222A - TRANS-08049 (SOT-23, 1A 40V) MPSA42 - TRANS-09116 (SOT-23, 500mA 300V) MMBT5088LT1G - TRANS-11160 (SOT-23, 50 mA 30V) BC547 - COM-08928 <http://www.sparkfun.com/products/8928> (TO-92 45V 100mA) (1.Collector 2.Base 3.Emitter) 2N3904 - COM-00521 <http://www.sparkfun.com/products/521> (TO-92 40V 200mA) (1.Emitter 2.Base 3.Collector) P2N2222A - COM-12852 <http://www.sparkfun.com/products/12852> (TO-92 40V 600mA) (1.Collector 2.Base 3.Emitter); PARTNO: BC817-25,215; PROD_ID: TRANS-08049
Q5 = SparkFun-DiscreteSemi:MOSFET-NCHANNEL: Common NMOSFET Parts MFG P/N Store ID Prod ID FDD8780 TRANS-09984 SI7820DN TRANS-11055 FDS6630A IC-08089 2N7002PW TRANS-11151 FQP30N06L COM-10213 TRANS-10060 BSS123LT1G TRANS-08345 BSS138 TRANS-00830 BS170 2N7000; PARTNO: SI1308EDL-T1-GE3; PROD_ID: TRANS-11151
R1 R6 R20 R31 R36 R37 = sha2017_rev0_1_0_dev:R0603-DASHES; PARTNO: ERJ-3GEYJ104V
R2 = resistor:R-EU_: RESISTOR, European symbol; PARTNO: ERJ-3GEYJ220V
R3 R12 R14 = sha2017_rev0_1_0_dev:R0603-DASHES; PARTNO: ERJ-3GEYJ102V
R4 R13 R15-R18 R25 = sha2017_rev0_1_0_dev:R0603-DASHES; PARTNO: ERJ-3GEYJ103V
R5 R8-R11 R27 R28 = 00ralf:R0603-DASHES; PARTNO: ERJ-3GEYJ103V
R7 R21 = sha2017_rev0_1_0_dev:R0603-DASHES; PARTNO: ERJ-3GEYJ224V
R19 = sha2017_rev0_1_0_dev:R0603-DASHES; PARTNO: ERJ-3GEYJ5R1V
R22-R24 = sha2017_rev0_1_0_dev:R0603-DASHES; OC_FARNELL: unknown; PARTNO: ERJ-3GEYJ103V
R29 R35 = sha2017_rev0_1_0_dev:R0603-DASHES; PARTNO: ERJ-3GEYJ222V
R30 = rcl:R-EU_: RESISTOR, European symbol; PARTNO: ERJ-3GEYJ154V
R32 = sha2017_rev0_1_0_dev:R0603-DASHES; PARTNO: ERJ-3GEYJ154V
S1 S2 = SparkFun-Electromechanical:SWITCH-MOMENTARY-2: Various NO switches- pushbuttons, reed, etc; PARTNO: SKQGABE010; PROD_ID: SWCH-08247
SJ3 = SparkFun-Passives:JUMPER-PAD-2-NO; PARTNO: NAP
T1-T3 = SparkFun-DiscreteSemi:MOSFET-PCHANNEL: Generic PMOSFET IRLML2244 - TRANS-11153 (SOT-23 -20V -4.3A) (1.Gate 2.Source 3.Drain) FQP27P06 - COM-10349 <http://www.sparkfun.com/products/10349> (TO-220 -60V -27A) (1.Gate 2.Source 3.Drain); PROD_ID: TRANS-08285
TOUCH_A TOUCH_B = badge:TOUCH; PARTNO: NAP
TOUCH_SEL = badge:TOUCH_CROSS; PARTNO: NAP
TOUCH_SELECT TOUCH_START = badge:TOUCH
TP1-TP3 TP100-TP140 = SparkFun-Passives:TEST-POINT: Bare copper test points for troubleshooting or ICT; PARTNO: NAP
U1 = Freescale_By_element14_Batch_1:MPR121QR2: Proximity Capacitive Touch Sensor Controller; MPN: MPR121QR2; OC_FARNELL: 1858714; OC_NEWARK: 24R9786; PACKAGE: QFN-20; SUPPLIER: Freescale
USB1 = usb_con-update:MOLEX-47346-0001: MICRO USB B, BOTTOM MOUNT; PARTNO: 10118192-0001LF
X1 = EAGLE-FPC_CONNECTOR_AND_FFC_CAB-rev1:68712414022: WR-FPC 0.5mm SMT ZIF Horizontal Top Contact, 24 Pins=>Code : Con_FPC_ZIF_0.50_68712414022 <http://katalog.we-online.de/media/images/eican/Con_FPC_ZIF_0.50_6871xx14022_pf2.jpg> Details see: http://katalog.we-online.de/en/em/687_1xx_140_22 Created 2014-07-09, Karrer Zheng 2014 (C) Würth Elektronik; PARTNO: 68712414022
X2 = con-3m:2908-: 3M Card Connector microSD Normal Polarisation, Push-Push, Surface-Mount, 2900 Series 2908-05WB-MG: Surface mount, right angle Supplier: DigiKey 3M5607CT-ND Source: http://solutions.3m.com/wps/portal/3M/en_US/FP/FireProtection/Products/ProductCatalog/?PC_7_RJH9U5230GE3E02LECFTDQ0R92_nid=GGFDLLB87CbeGKZPW31NMHgl; PARTNO: 2908-05WB-MG
X3 = EAGLE-BOARD-TO-BOARD_CONNECTORS-rev16c:610X12243021: WR-PHD 2.54mm SMT Dual Socket Header Bottom Entry, 12 Pins=>Code : Con_BTB_SHD_2.54_2_610x12243021(packageing:x = 0: Tube x = 3: Tape & Reel with Cap) <http://katalog.we-online.de/media/images/eican/Con_BTB_SHD_2.54_2_6100xx243021_pf2.jpg> Details see: 6100xx243021 http://katalog.we-online.de/en/em/PHD_2_54_SMT_DUAL_SOCKET_HEADER_BOTTOM_ENTRY_6100XX243021 6103xx243021 http://katalog.we-online.de/en/em/PHD_2_54_SMT_DUAL_SOCKET_HEADER_BOTTOM_ENTRY_6103XX243021 2014 (C) Würth Elektronik; PARTNO: 517-153208-2020-TB
X4 = badge:JST-PH3

## Net classes
1 FAT: width 0.2 mm, drill 0.4 mm
2 GND/3V3: width 0.2 mm, drill 0.4 mm
3 Touch: width 0.2 mm, clearance 1 mm
4 touch prox: width 0.2 mm, clearance 1.6 mm